# EAGLE design pic24rgbrnd01-r2b (EAGLE 7.7.0)
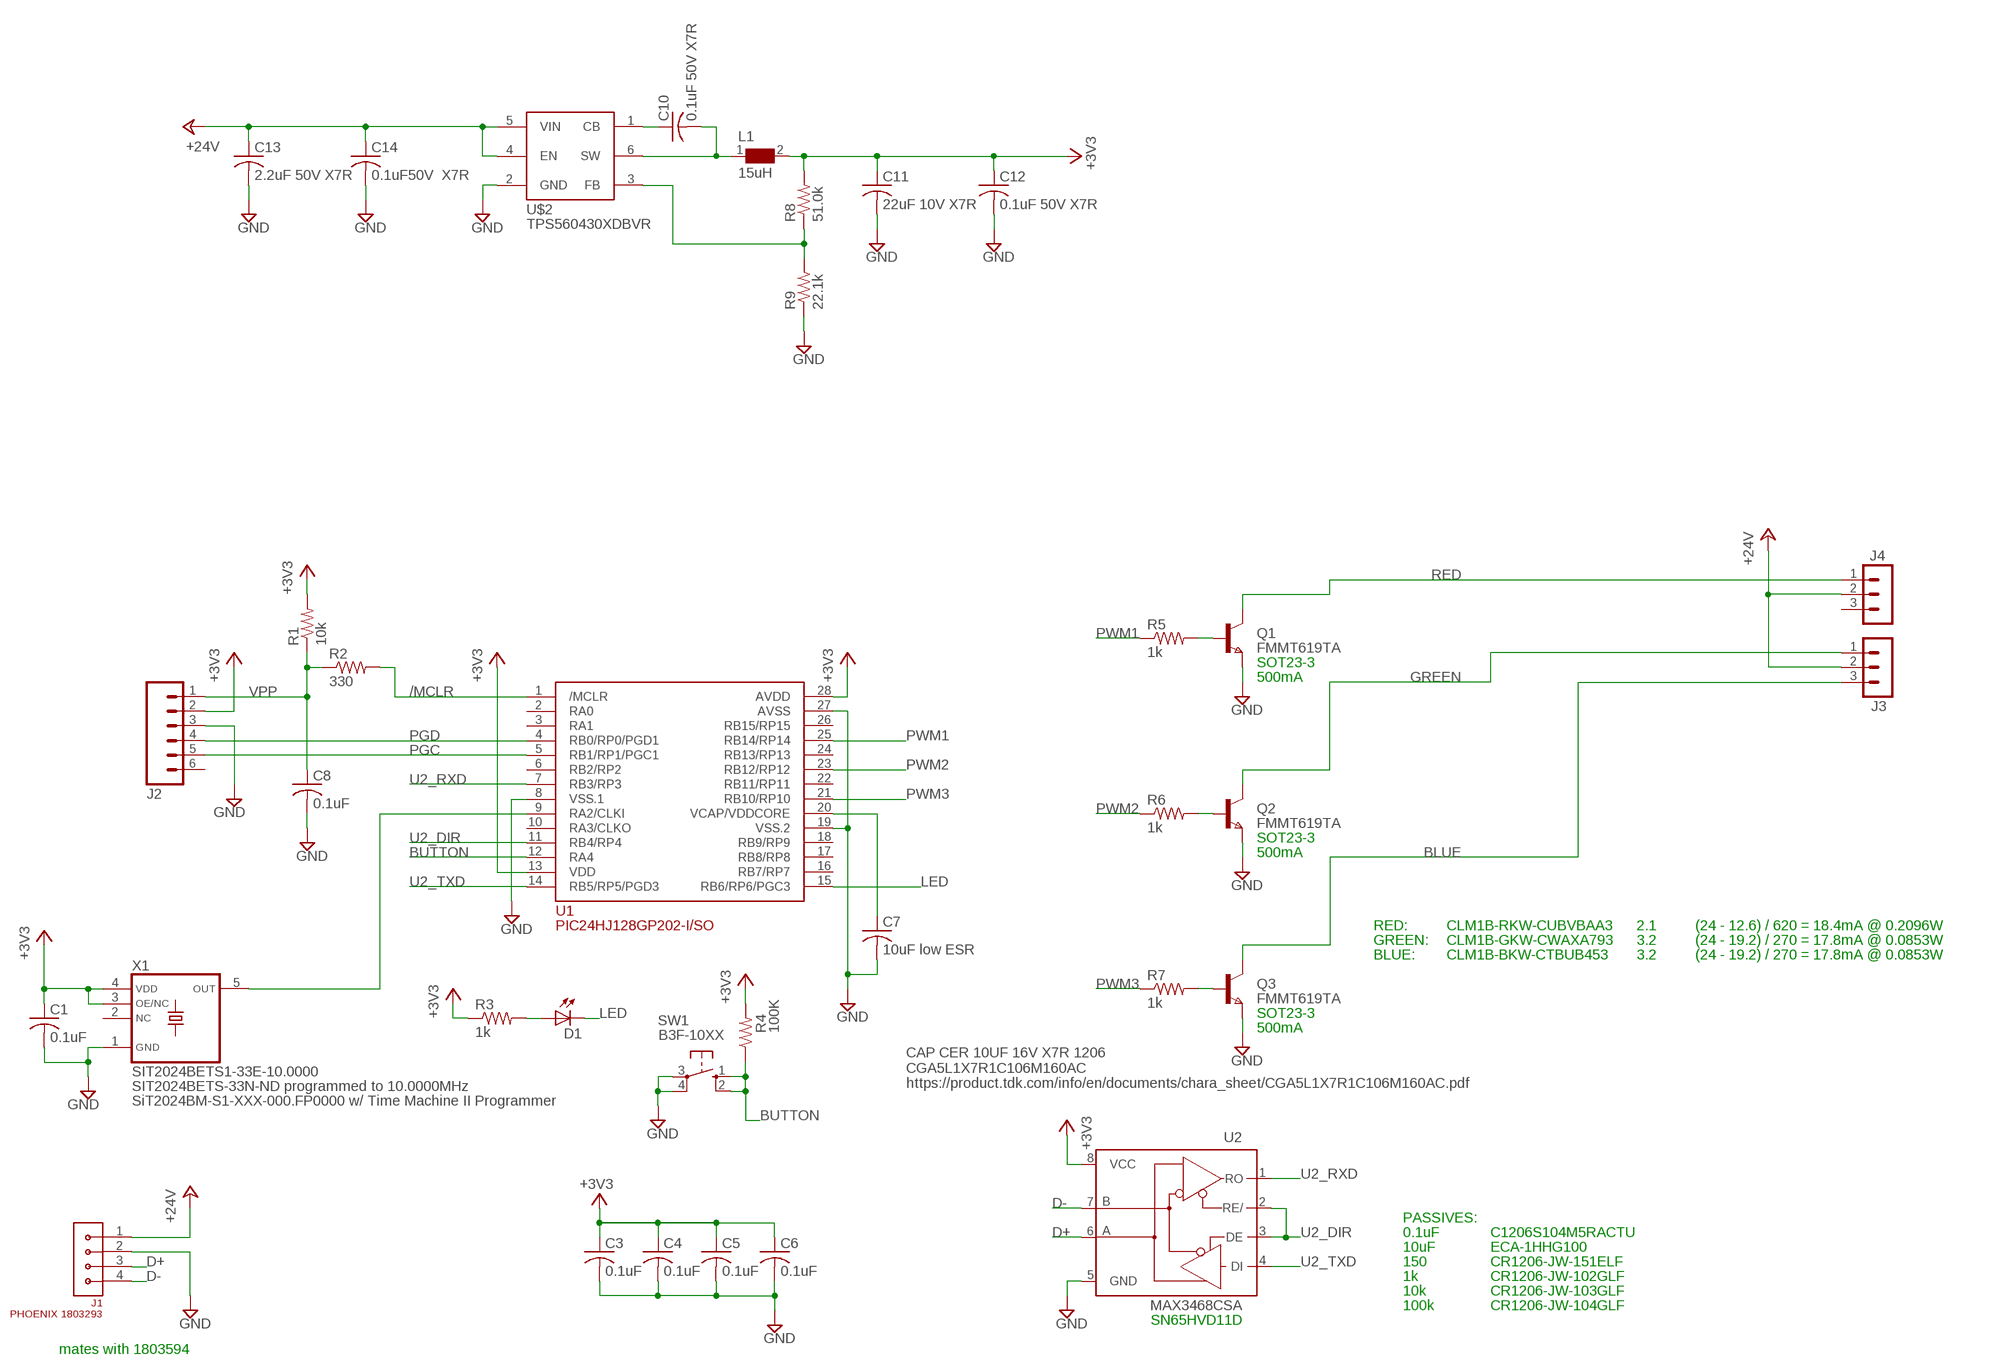
[diagram p0: schematic, sheet 1]

## Parts
C1  0.1uF  C-USC0805  [C0805]
C3  0.1uF  C-USC0805  [C0805]
C4  0.1uF  C-USC0805  [C0805]
C5  0.1uF  C-USC0805  [C0805]
C6  0.1uF  C-USC0805  [C0805]
C7  10uF low ESR  C-USC1206  [C1206]
C8  0.1uF  C-USC0805  [C0805]
C10  0.1uF 50V X7R  C-USC0805  [C0805]
C11  22uF 10V X7R  C-USC1206K  [C1206K]
C12  0.1uF 50V X7R  C-USC0805  [C0805]
C13  2.2uF 50V X7R  C-USC1210K  [C1210K]
C14  0.1uF50V X7R  C-USC0805  [C0805]
D1  LED3MM  [LED3MM]
J1  PHOENIX 1803293  CON-3.81MM-1X4-PHOENIX-1803293  [CON-PHOENIX-1803293-3.81-1X4]
J2  M06SIP  [1X06]
J3  MA03-1  [MA03-1]
J4  MA03-1  [MA03-1]
L1  15uH  WE-SPC_48XX-74408943150_4838/4828/4818  [WE-SPC_48XX]
Q1  FMMT619TA  NPNSOT23  [SOT-23]
Q2  FMMT619TA  NPNSOT23  [SOT-23]
Q3  FMMT619TA  NPNSOT23  [SOT-23]
R1  10k  R-US_R0805  [R0805]
R2  330  R-US_R0805  [R0805]
R3  1k  R-US_R0805  [R0805]
R4  100K  R-US_R0805  [R0805]
R5  1k  R-US_R0805  [R0805]
R6  1k  R-US_R0805  [R0805]
R7  1k  R-US_R0805  [R0805]
R8  51.0k  R-US_R0805  [R0805]
R9  22.1k  R-US_R0805  [R0805]
SW1  B3F-10XX  10-XX  [B3F-10XX]
U1  PIC24HJ128GP202-I/SO  [SO28W]
U2  MAX3468CSA  [SO08]
U$2  TPS560430XDBVR  [SOT23-6]
X1  SIT2024BETS1-33E-10.0000  [SOT23-5]

## Nets
+3V3: C1.1 C3.1 C4.1 C5.1 C6.1 C11.1 C12.1 J2.2 L1.2 R1.2 R3.1 R4.2 R8.2 U1.13(VDD) U1.28(AVDD) U2.8(VCC) X1.3(OE/NC) X1.4(VDD)
+24V: C13.1 C14.1 J1.1 J3.2 J4.2 U$2.4(EN) U$2.5(VIN)
/MCLR: R2.2 U1.1(/MCLR)
BLUE: J3.3 Q3.1(C)
BUTTON: R4.1 SW1.1(S) SW1.2(S1) U1.12(RA4)
CB: C10.1 U$2.1(CB)
D+: J1.3 U2.6(A)
D-: J1.4 U2.7(B)
FB: R8.1 R9.2 U$2.3(FB)
GND: C1.2 C3.2 C4.2 C5.2 C6.2 C7.2 C8.2 C11.2 C12.2 C13.2 C14.2 J1.2 J2.3 Q1.2(E) Q2.2(E) Q3.2(E) R9.1 SW1.3(P) SW1.4(P1) U1.8(VSS.1) U1.19(VSS.2) U1.27(AVSS) U2.5(GND) U$2.2(GND) X1.1(GND)
GREEN: J3.1 Q2.1(C)
LED: D1.K(C) U1.15(RB6/RP6/PGC3)
N$4: C7.1 U1.20(VCAP/VDDCORE)
N$5: U1.9(RA2/CLKI) X1.5(OUT)
N$112: Q1.3(B) R5.2
N$113: Q2.3(B) R6.2
N$114: Q3.3(B) R7.2
N$115: D1.A R3.2
PGC: J2.5 U1.5(RB1/RP1/PGC1)
PGD: J2.4 U1.4(RB0/RP0/PGD1)
PWM1: R5.1 U1.25(RB14/RP14)
PWM2: R6.1 U1.23(RB12/RP12)
PWM3: R7.1 U1.21(RB10/RP10)
RED: J4.1 Q1.1(C)
SW: C10.2 L1.1 U$2.6(SW)
U2_DIR: U1.11(RB4/RP4) U2.2(RE/) U2.3(DE)
U2_RXD: U1.7(RB3/RP3) U2.1(RO)
U2_TXD: U1.14(RB5/RP5/PGD3) U2.4(DI)
VPP: C8.1 J2.1 R1.1 R2.1
Unconnected: J2.6 J4.3 U1.2(RA0) U1.3(RA1) U1.6(RB2/RP2) U1.10(RA3/CLKO) U1.16(RB7/RP7) U1.17(RB8/RP8) U1.18(RB9/RP9) U1.22(RB11/RP11) U1.24(RB13/RP13) U1.26(RB15/RP15) X1.2(NC)

## Notes on the sheet
- SOT23-3
- 500mA
- SOT23-3
- 500mA
- RED: | CLM1B-RKW-CUBVBAA3 | 2.1 | (24 - 12.6) / 620 = 18.4mA @ 0.2096W
- GREEN: | CLM1B-GKW-CWAXA793 | 3.2 | (24 - 19.2) / 270 = 17.8mA @ 0.0853W
- BLUE: | CLM1B-BKW-CTBUB453 | 3.2 | (24 - 19.2) / 270 = 17.8mA @ 0.0853W
- SOT23-3
- 500mA
- CAP CER 10UF 16V X7R 1206
  CGA5L1X7R1C106M160AC 
  https://product.tdk.com/info/en/documents/chara_sheet/CGA5L1X7R1C106M160AC.pdf
- SIT2024BETS-33N-ND programmed to 10.0000MHz
- SiT2024BM-S1-XXX-000.FP0000 w/ Time Machine II Programmer
- PASSIVES:
- 0.1uF | C1206S104M5RACTU
- 10uF | ECA-1HHG100
- 150 | CR1206-JW-151ELF
- 1k | CR1206-JW-102GLF
- 10k | CR1206-JW-103GLF
- 100k | CR1206-JW-104GLF
- SN65HVD11D
- mates with 1803594

## Library data of the parts
C1 C3-C6 C8 C10 C12 C14 = rcl:C-US: CAPACITOR, American symbol
C7 = resistor:C-US: CAPACITOR, American symbol
C11 = rcl:C-US: CAPACITOR, American symbol; MFR: KEMET; MFR_PART_NO: C1206C226K8RAC7800
C13 = rcl:C-US: CAPACITOR, American symbol; MFR: KEMET; MFR_PART_NO: C1210C106K5RACTU
D1 = led:LED: LED OSRAM: - CHIPLED LG R971, LG N971, LY N971, LG Q971, LY Q971, LO R971, LY R971 LH N974, LH R974 LS Q976, LO Q976, LY Q976 LO Q996 - Hyper CHIPLED LW Q18S LB Q993, LB Q99A, LB R99A - SideLED LS A670, LO A670, LY A670, LG A670, LP A670 LB A673, LV A673, LT A673, LW A673 LH A674 LY A675 LS A676, LA A676, LO A676, LY A676, LW A676 LS A679, LY A679, LG A679 - Hyper Micro SIDELED® LS Y876, LA Y876, LO Y876, LY Y876 LT Y87S - SmartLED LW L88C, LW L88S LB L89C, LB L89S, LG L890 LS L89K, LO L89K, LY L89K LS L896, LA L896, LO L896, LY L896 - TOPLED LS T670, LO T670, LY T670, LG T670, LP T670 LSG T670, LSP T670, LSY T670, LOP T670, LYG T670 LG T671, LOG T671, LSG T671 LB T673, LV T673, LT T673, LW T673 LH T674 LS T676, LA T676, LO T676, LY T676, LB T676, LH T676, LSB T676, LW T676 LB T67C, LV T67C, LT T67C, LS T67K, LO T67K, LY T67K, LW E67C LS E67B, LA E67B, LO E67B, LY E67B, LB E67C, LV E67C, LT E67C LW T67C LS T679, LY T679, LG T679 LS T770, LO T770, LY T770, LG T770, LP T770 LB T773, LV T773, LT T773, LW T773 LH T774 LS E675, LA E675, LY E675, LS T675 LS T776, LA T776, LO T776, LY T776, LB T776 LHGB T686 LT T68C, LB T68C - Hyper Mini TOPLED® LB M676 - Mini TOPLED Santana® LG M470 LS M47K, LO M47K, LY M47K Source: http://www.osram.convergy.de LUXEON: - LUMILED® LXK2-PW12-R00, LXK2-PW12-S00, LXK2-PW14-U00, LXK2-PW14-V00 LXK2-PM12-R00, LXK2-PM12-S00, LXK2-PM14-U00 LXK2-PE12-Q00, LXK2-PE12-R00, LXK2-PE12-S00, LXK2-PE14-T00, LXK2-PE14-U00 LXK2-PB12-K00, LXK2-PB12-L00, LXK2-PB12-M00, LXK2-PB14-N00, LXK2-PB14-P00, LXK2-PB14-Q00 LXK2-PR12-L00, LXK2-PR12-M00, LXK2-PR14-Q00, LXK2-PR14-R00 LXK2-PD12-Q00, LXK2-PD12-R00, LXK2-PD12-S00 LXK2-PH12-R00, LXK2-PH12-S00 LXK2-PL12-P00, LXK2-PL12-Q00, LXK2-PL12-R00 Source: www.luxeon.com KINGBRIGHT: KA-3528ASYC Source: www.kingbright.com
J1 = 0GlenConnectors:CON-3.81MM-1X4-PHOENIX-1803293
J2 = SparkFun-Connectors:M06: Header 6 Standard 6-pin 0.1" header. Use with straight break away headers (SKU : PRT-00116), right angle break away headers (PRT-00553), swiss pins (PRT-00743), machine pins (PRT-00117), and female headers (PRT-00115). Molex polarized connector foot print use with SKU : PRT-08094 with associated crimp pins and housings. NOTES ON THE VARIANTS LOCK and LOCK_LONGPADS... This footprint was designed to help hold the alignment of a through-hole component (i.e. 6-pin header) while soldering it into place. You may notice that each hole has been shifted either up or down by 0.005 of an inch from it's more standard position (which is a perfectly straight line). This slight alteration caused the pins (the squares in the middle) to touch the edges of the holes. Because they are alternating, it causes a "brace" to hold the component in place. 0.005 has proven to be the perfect amount of "off-center" position when using our standard breakaway headers. Although looks a little odd when you look at the bare footprint, once you have a header in there, the alteration is very hard to notice. Also,if you push a header all the way into place, it is covered up entirely on the bottom side. This idea of altering the position of holes to aid alignment will be further integrated into the Sparkfun Library for other footprints. It can help hold any component with 3 or more connection pins.
J3 J4 = con-lstb:MA03-1: PIN HEADER
L1 = WE-SPC_48XX:WE-SPC_48XX: SMD-Shielded Power Inductor WE-SPC; MPN: 74408943150; OC_FARNELL: 2066943; OC_NEWARK: 74T0835; PACKAGE: 4838; SUPPLIER: WURTH ELEKTRONIK
Q1-Q3 = zetex:NPNSOT23: NPN TRANSISTOR; MPN: DSS20201L-7; OC_FARNELL: 1710688; OC_NEWARK: 25R4555
R1-R9 = rcl:R-US_: RESISTOR, American symbol
SW1 = switch-omron:10-XX: OMRON SWITCH
U1 = GlenPartsLibrary:PIC24HJ128GP202-I/SO
U2 = maxim:MAX34*: +5V, Fail-Safe, 40Mbps, Profibus RS-485/RS-422 Transceivers Source: MAX3465-MAX3469.pdf; MPN: MAX3468CSA+; OC_FARNELL: unknown; OC_NEWARK: 76K6721
U$2 = GlenPartsLibrary:TPS560430XDBVR
X1 = Glen-SiTime:SIT2024BETS1-33E-10.0000

## Board
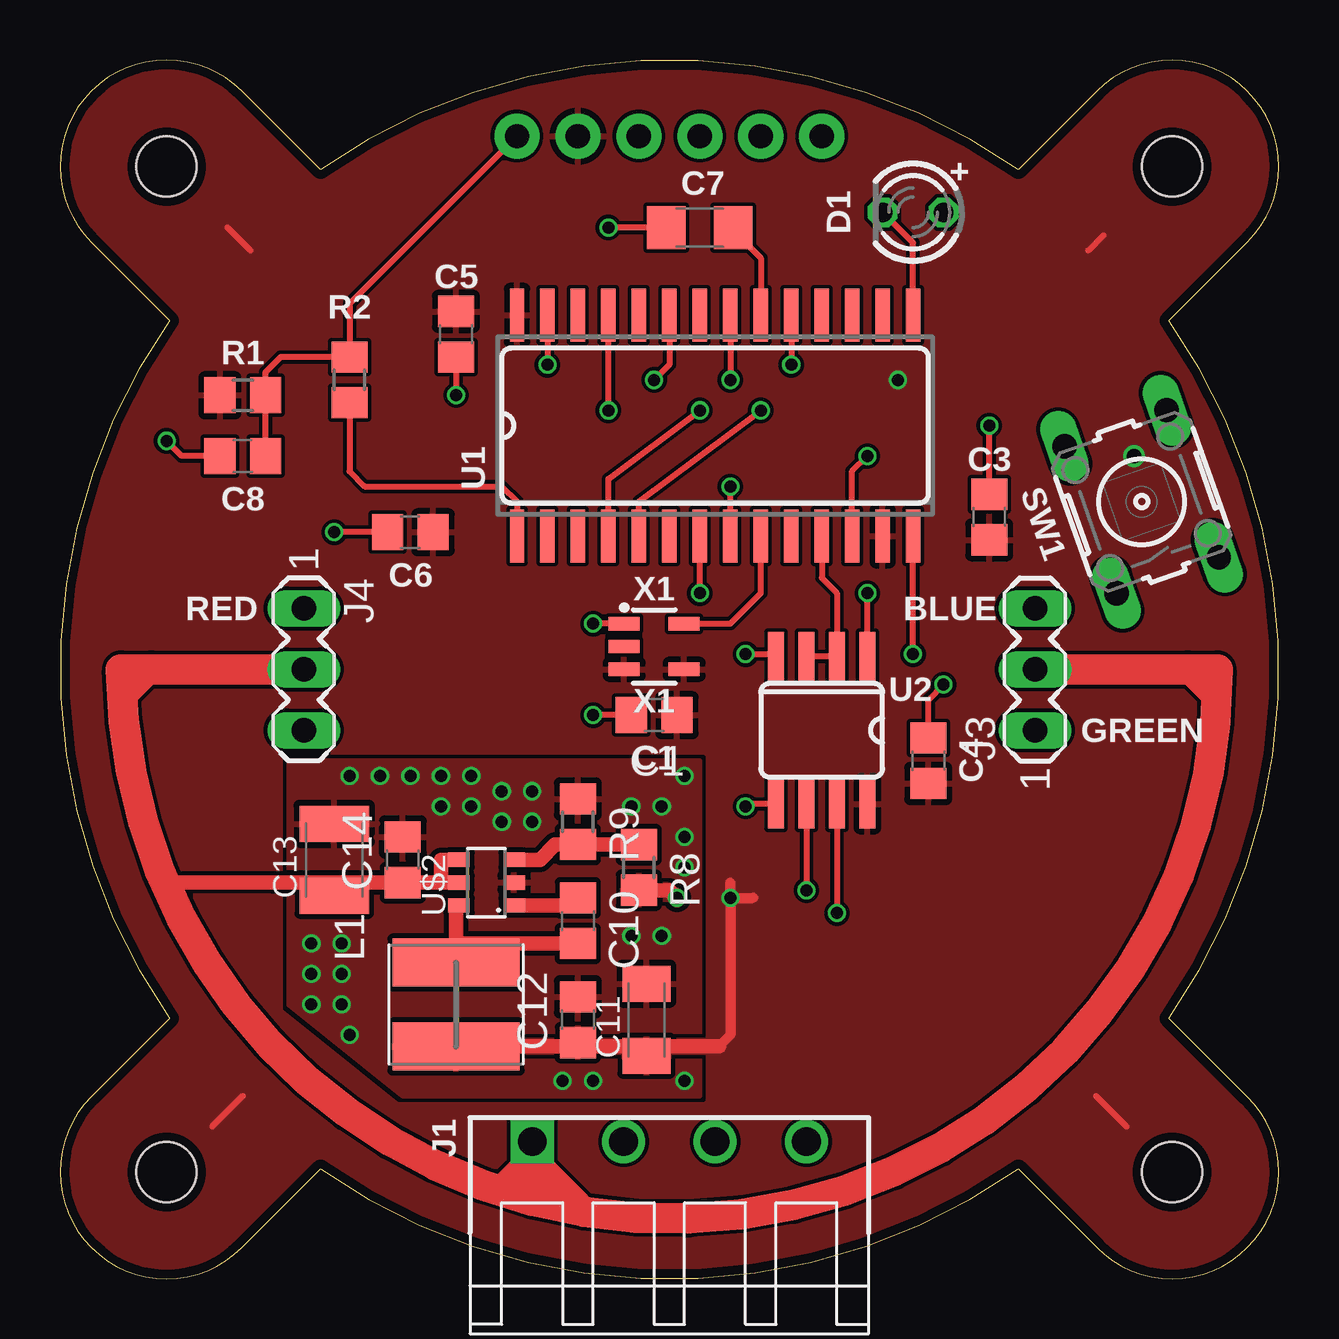
[diagram p1: board, top side]
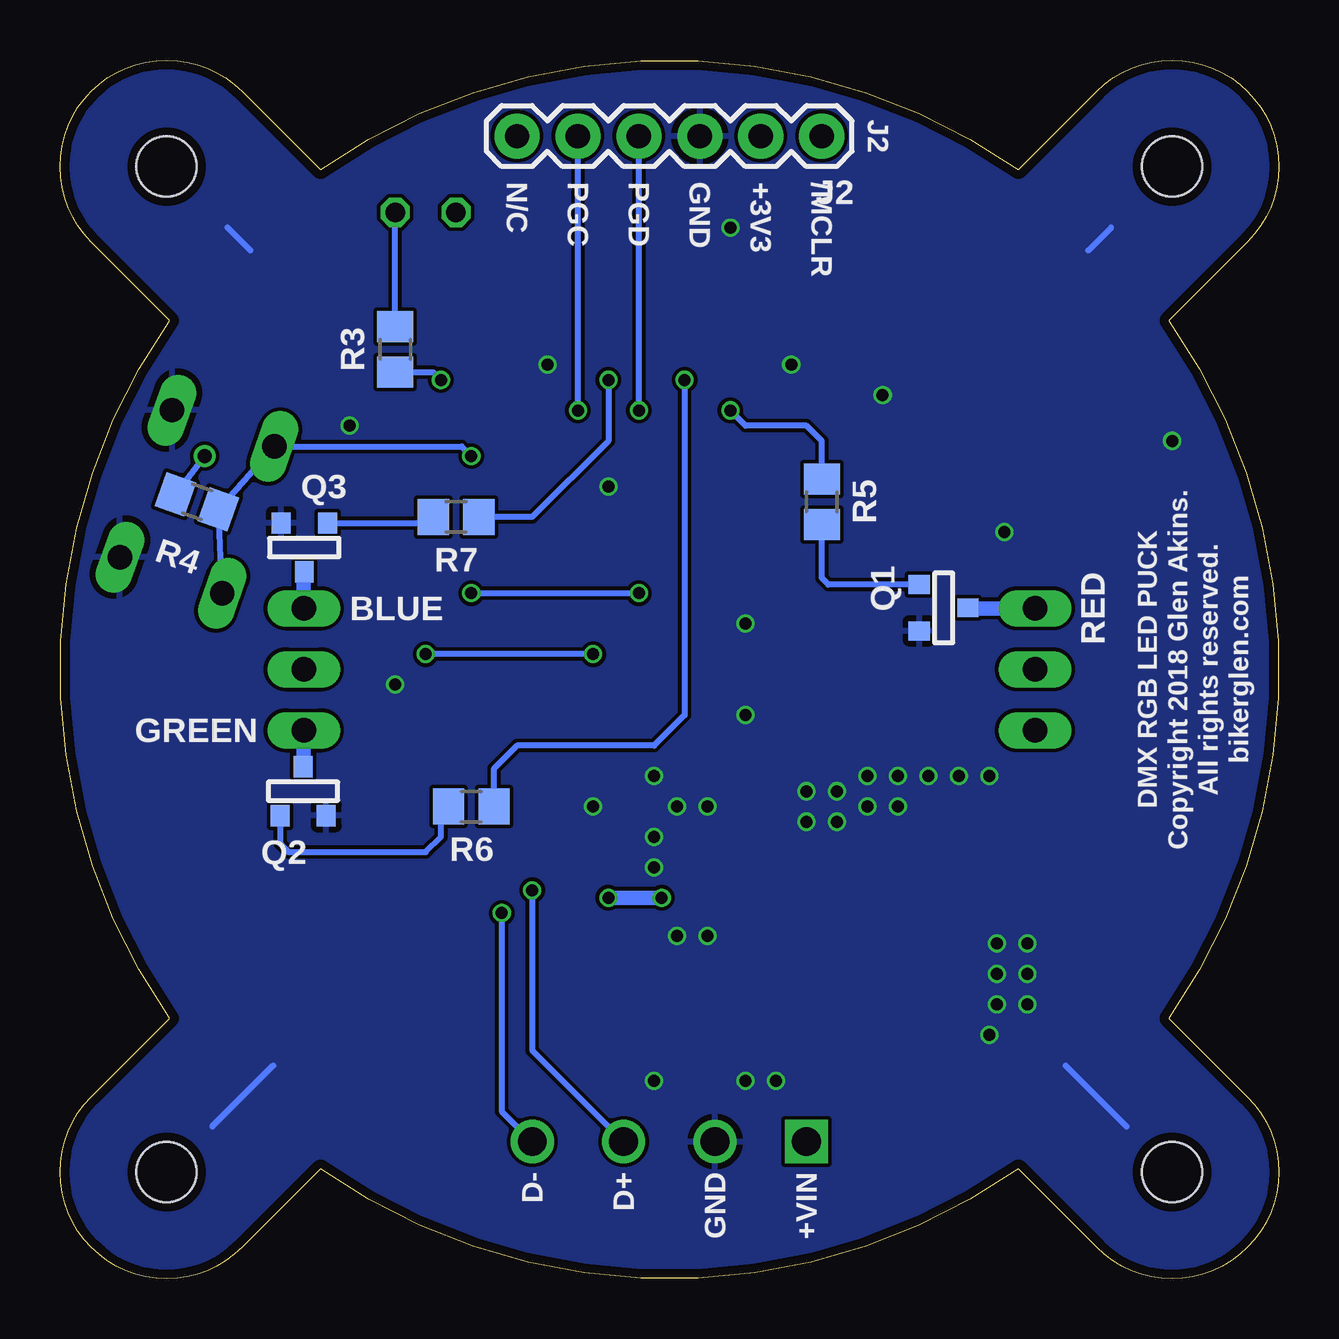
[diagram p2: board, bottom side, seen from below]

Size 50.8 x 50.8 mm. Coordinates in mm from the lower left corner, seen from the top.
Outline: 39.94,4.57 43.21,1.3 arc180 49.5,7.59 46.23,10.86 arc70 46.23,39.94 49.5,43.21 arc180 43.21,49.5 39.94,46.23 arc70 10.86,46.23 7.59,49.5 arc180 1.3,43.21 4.57,39.94 arc70 4.57,10.86 1.3,7.59 arc180 7.59,1.3 10.86,4.57 arc70 39.94,4.57
Copper layers (1*16): Top 0.035559375mm / dielectric 1.6mm / Bottom 0.035559375mm
Design rules "oshpark-2layer-2018": minimum track width 6mil, minimum drill 10mil, track to track 6mil, track to pad 6mil, pad to pad 6mil, via to via 6mil, smd to smd 6mil, copper to edge 15mil, drill to drill 6mil, minimum pad ring 5mil, minimum via ring 5mil, stop-mask expansion 2.5mil, vias tented up to drill 0mil, thermal gap 10mil
Holes 2.5 mm at 4.45,46.36 46.36,46.36 46.36,4.45 4.45,4.45
tKeepout: area 1.7,1.7 to 7.2,7.2; area 43.6,1.7 to 49.1,7.2; area 43.6,43.6 to 49.1,49.1; area 1.7,43.6 to 7.2,49.1
bKeepout: area 1.7,43.6 to 7.2,49.1; area 43.6,43.6 to 49.1,49.1; area 43.6,1.7 to 49.1,7.2; area 1.7,1.7 to 7.2,7.2

### Footprints (pad centres in the part's own frame; a part is rotated, then mirrored left to right if it is on the bottom)
C0805 = smd 1.3 x 1.5: 1 -0.95,0; 2 0.95,0
C1206 = smd 1.6 x 1.8: 1 -1.4,0; 2 1.4,0
C1206K = smd 1.5 x 2: 1 -1.5,0; 2 1.5,0
C1210K = smd 1.5 x 2.9: 1 -1.5,0; 2 1.5,0
LED3MM = drill 0.813 octagon: A -1.27,0; K 1.27,0
CON-PHOENIX-1803293-3.81-1X4 = drill 1.2 square: 1 0,0 | drill 1.2: 2 3.81,0; 3 7.62,0; 4 11.43,0
1X06 = drill 1.016 pad 1.88: 1 0,0; 2 2.54,0; 3 5.08,0; 4 7.62,0; 5 10.16,0; 6 12.7,0
MA03-1 = drill 1.016 long: 1 -2.54,0; 2 0,0; 3 2.54,0
WE-SPC_48XX = smd 2 x 5.3: 1 -1.75,0; 2 1.75,0
SOT-23 = smd 0.787 x 0.889: 1 0.025,-1.016; 2 -0.94,1.016; 3 0.991,1.016
R0805 = smd 1.3 x 1.5: 1 -0.95,0; 2 0.95,0
B3F-10XX = drill 1.016 long: 1 -3.251,2.261; 2 3.251,2.261; 3 -3.251,-2.261; 4 3.251,-2.261
SO28W = smd 0.6 x 2.2: 1 -8.255,-4.6; 2 -6.985,-4.6; 3 -5.715,-4.6; 4 -4.445,-4.6; 5 -3.175,-4.6; 6 -1.905,-4.6; 7 -0.635,-4.6; 8 0.635,-4.6; 9 1.905,-4.6; 10 3.175,-4.6; 11 4.445,-4.6; 12 5.715,-4.6; 13 6.985,-4.6; 14 8.255,-4.6; 15 8.255,4.6; 16 6.985,4.6; 17 5.715,4.6; 18 4.445,4.6; 19 3.175,4.6; 20 1.905,4.6; 21 0.635,4.6; 22 -0.635,4.6; 23 -1.905,4.6; 24 -3.175,4.6; 25 -4.445,4.6; 26 -5.715,4.6; 27 -6.985,4.6; 28 -8.255,4.6
SO08 = smd 0.66 x 2.032: 1 -1.905,-3.073; 2 -0.635,-3.073; 3 0.635,-3.073; 4 1.905,-3.073; 5 1.905,3.073; 6 0.635,3.073; 7 -0.635,3.073; 8 -1.905,3.073
SOT23-6 = smd 0.6 x 0.9: 1 -0.95,-1.15; 2 0,-1.15; 3 0.95,-1.15; 4 0.95,1.15; 5 0,1.15; 6 -0.95,1.15
SOT23-5 = smd 1.3 x 0.55: 1 -1.25,0.95; 2 -1.25,0; 3 -1.25,-0.95; 4 1.25,-0.95; 5 1.25,0.95

### Placement (x,y rotation side)
C1  24.77,23.5 180 top
C3  38.74,31.75 90 top
C4  36.2,21.59 90 top
C5  16.51,39.37 270 top
C6  14.61,31.12 180 top
C7  26.67,43.82 180 top
C8  7.62,34.29 180 top
C10  21.59,14.92 270 top
C11  24.45,10.8 90 top
C12  21.59,10.8 90 top
C13  11.43,17.46 90 top
C14  14.29,17.46 90 top
D1  35.56,44.45 180 top
J1  19.69,5.72 0 top
J2  19.05,47.63 180 bottom
J3  40.64,25.4 90 top
J4  10.16,25.4 270 top
L1  16.51,11.43 270 top
Q1  13.97,27.94 90 bottom
Q2  40.64,20.32 180 bottom
Q3  40.64,30.48 0 bottom
R1  7.62,36.83 180 top
R2  12.07,37.47 270 top
R3  36.83,38.74 90 bottom
R4  45.09,32.39 160.5 bottom
R5  19.05,32.39 270 bottom
R6  33.66,19.69 180 bottom
R7  34.29,31.75 180 bottom
R8  24.13,17.15 270 top
R9  21.59,19.05 270 top
SW1  45.09,32.39 109.5 top
U1  27.31,35.56 0 top
U2  31.75,22.86 180 top
U$2  17.78,16.51 90 top
X1  24.77,26.35 0 top

### Tracks (layer width: path | path; a pad name or v marks a point on that pad's centre or on a via)
+3V3  (via drill 0.5, 0.6)
  Top 0.254: 6.99,43.82 7.94,42.86 | 42.86,42.86 43.5,43.5 | 43.18,7.62 44.45,6.35 | 7.62,7.62 6.35,6.35
  Top 0.406: C11.1 24.13,9.68 | C12.1 21.59,9.68 | v27.94,15.88 27.94,16.51 | v27.94,15.88 28.89,15.88 | v27.94,15.88 27.94,10.16 27.46,9.68
  Top 0.61: L1.2 21.59,9.68 24.13,9.68 27.46,9.68 | R8.2 25.4,16.2 v25.72,15.88
  Bottom 0.254: R3.1 35.25,37.79 v34.93,37.47 | v44.77,34.29 R4.2
  Bottom 0.61: v25.72,15.88 v27.94,15.88
  pour Top (isolate 0.203, rank 6): 4.57,39.94 1.3,43.21 arc-180 7.59,49.5 10.86,46.23
  pour Top (isolate 0.203, rank 6): 39.94,46.23 43.21,49.5 arc-180 49.5,43.21 46.23,39.94
  pour Top (isolate 0.203, rank 6): 46.23,10.86 49.5,7.59 arc-180 43.21,1.3 39.94,4.57
  pour Top (isolate 0.203, rank 6): 10.86,4.57 7.59,1.3 arc-180 1.3,7.59 4.57,10.86
  pour Top (isolate 0.152, rank 6): 0,25.4 arc-90 25.4,50.8 arc-90 50.8,25.4 arc-90 25.4,0 arc-90
+24V
  Top 0.406: C14.1 13.97,16.51 | C13.1 11.43,16.51 | 4.45,16.51 4.45,17.46 4.13,17.78 4.13,18.42 3.49,19.05 3.49,20.32 3.18,20.64 3.18,21.91 2.54,22.54 2.54,24.13
  Top 0.61: U$2.5 15.88,16.51 | 15.88,16.51 13.97,16.51 11.43,16.51 | 11.43,16.51 8.89,16.51 | U$2.4 15.88,17.46 15.88,16.51 | 11.43,16.51 4.45,16.51
  Top 1.016: 19.69,3.25 19.69,5.08 | 19.69,5.08 J1.1 | 3.81,25.4 2.54,24.13 | 46.99,25.4 48.26,24.13 | 19.69,5.08 18.42,3.81 | 19.69,5.08 21.59,3.18 20.96,3.18 20.32,3.81
  Top 1.27: J4.2 3.81,25.4 2.54,25.4 arc75 19.69,3.25 arc105 48.26,25.4 46.99,25.4 J3.2
/MCLR
  Top 0.254: U1.1 19.05,32.39 18.42,33.02 12.7,33.02 12.07,33.66 R2.2
BLUE
  Bottom 0.61: J3.3 40.64,29.44 Q3.1
BUTTON  (via drill 0.5)
  Top 0.254: U1.12 33.02,33.66 v33.66,34.29
  Bottom 0.254: v33.66,34.29 34.06,34.7 SW1.2 R4.1 SW1.1
CB
  Top 0.406: 21.59,15.56 C10.1
  Top 0.61: U$2.1 21.59,15.56
D+  (via drill 0.5)
  Top 0.254: U2.6 v31.12,16.19
  Bottom 0.254: v31.12,16.19 31.12,9.53 J1.3
D-  (via drill 0.5)
  Top 0.254: U2.7 v32.39,15.24
  Bottom 0.254: v32.39,15.24 32.39,6.99 J1.4
FB
  Top 0.406: R9.2
  Top 0.61: U$2.3 20,17.46 20.64,18.1 R9.2 | R8.1 R9.2
GND  (via drill 0.5)
  Top 0.254: U1.27 v20.32,38.1 | C5.2 v16.51,36.83 | C6.2 v11.43,31.12 | C8.2 5.08,34.29 v4.45,34.93 | U2.5 28.68,19.79 v28.58,19.69 | C4.2 36.2,24.13 v36.83,24.77 | C7.2 v22.86,43.82 | C3.2 v38.74,35.56 | U1.19 v30.48,38.1 | U1.8 v27.94,33.02 | X1.1 v22.23,27.3 v22.23,27.31 | C1.2 v22.23,23.5
  Bottom 0.254: 6.99,43.82 7.94,42.86 | 43.82,43.82 42.86,42.86 | 41.91,8.89 44.45,6.35 | 6.35,6.35 8.89,8.89
  other vias: 12.07,20.96 13.34,20.96 14.61,20.96 15.88,20.96 15.88,19.69 17.15,20.96 17.15,19.69 18.42,20.32 18.42,19.05 19.69,19.05 19.69,20.32 23.81,19.69 25.08,19.69 25.08,14.29 23.81,14.29 11.75,13.97 10.48,13.97 10.48,12.7 11.75,12.7 10.48,11.43 11.75,11.43 12.07,10.16 20.96,8.26 22.23,8.26 26.04,8.26 26.04,20.96 26.04,18.42 26.04,17.15
  pour Top (isolate 0.203): 26.67,7.62 26.67,21.59 9.53,21.59 9.53,11.43 14.29,7.62
  pour Bottom (isolate 0.203): 4.57,39.94 1.3,43.21 arc-180 7.59,49.5 10.86,46.23
  pour Bottom (isolate 0.203): 39.94,46.23 43.21,49.5 arc-180 49.5,43.21 46.23,39.94
  pour Bottom (isolate 0.203): 46.23,10.86 49.5,7.59 arc-180 43.21,1.3 39.94,4.57
  pour Bottom (isolate 0.203): 10.86,4.57 7.59,1.3 arc-180 1.3,7.59 4.57,10.86
  pour Bottom (isolate 0.152): 0,25.4 arc-90 25.4,50.8 arc-90 50.8,25.4 arc-90 25.4,0 arc-90
GREEN
  Bottom 0.61: J3.1 40.64,21.36 Q2.1
LED
  Top 0.254: U1.15 35.56,43.18 D1.K
N$4
  Top 0.254: C7.1 28.07,43.69 29.21,42.55 U1.20
N$5
  Top 0.254: U1.9 29.21,28.58 27.94,27.3 X1.5
N$112
  Bottom 0.254: Q1.3 18.77,28.93 19.05,29.21 R5.2
N$113
  Bottom 0.254: Q2.3 41.63,18.14 41.28,17.78 35.56,17.78 34.93,18.42 34.93,19.53 R6.2
N$114
  Bottom 0.254: Q3.3 35.97,31.5 R7.2
N$115
  Bottom 0.254: R3.2 D1.A
PGC  (via drill 0.5)
  Top 0.254: U1.5 24.13,32.39 v29.21,36.2
  Bottom 0.254: v29.21,36.2 J2.5
PGD  (via drill 0.5)
  Top 0.254: U1.4 22.86,33.34 v26.67,36.2
  Bottom 0.254: v26.67,36.2 J2.4
PWM1  (via drill 0.5)
  Top 0.254: v22.86,36.2 U1.25
  Bottom 0.254: R5.1 19.05,34.93 19.69,35.56 22.23,35.56 v22.86,36.2
PWM2  (via drill 0.5)
  Top 0.254: U1.23 25.4,38.1 v24.77,37.47
  Bottom 0.254: v24.77,37.47 24.77,23.5 26.04,22.23 31.75,22.23 32.71,21.27 R6.1
PWM3  (via drill 0.5)
  Top 0.254: U1.21 v27.94,37.47
  Bottom 0.254: v27.94,37.47 27.94,34.93 31.12,31.75 R7.1
RED
  Bottom 0.61: J4.1 12.93,27.94 Q1.1
SW
  Top 0.406: 16.51,13.97 L1.1 | U$2.6 16.51,15.56
  Top 0.61: C10.2 16.51,13.97 16.51,15.56
U2_DIR
  Top 0.254: U2.3 U2.2 32.39,28.58 31.75,29.21 U1.11
U2_RXD  (via drill 0.5)
  Top 0.254: U2.1 v33.66,28.58 | v26.67,28.58 U1.7
  Bottom 0.254: v33.66,28.58 v26.67,28.58
U2_TXD  (via drill 0.5)
  Top 0.254: v35.56,26.04 U1.14 | v28.58,26.04 29.74,26.04 U2.4
  Bottom 0.254: v28.58,26.04 v35.56,26.04
VPP
  Top 0.254: J2.1 12.07,40.64 R2.1 9.21,38.42 8.57,37.78 R1.1 C8.1

### Text on the board
_tsilk: + | RED | X1 | BLUE | GREEN | C1
_bsilk: J2 | /MCLR | +3V3 | GND | PGD | PGC | N/C | RED | BLUE | bikerglen.com | All rights reserved. | Copyright 2018 Glen Akins. | DMX RGB LED PUCK | GREEN | +VIN | GND | D+ | D-